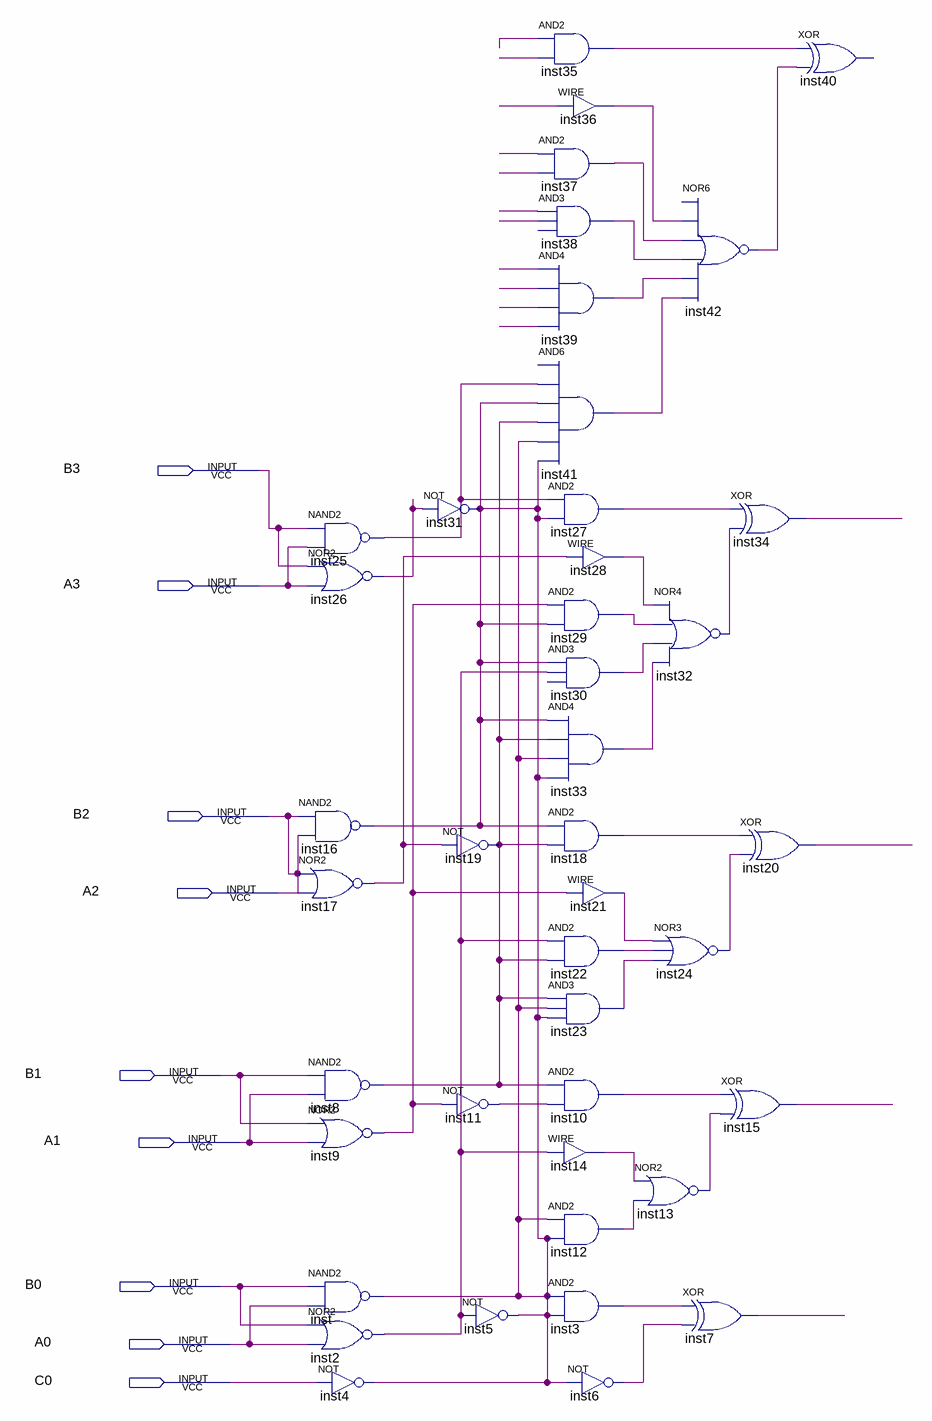
[diagram p0: schematic sheet]
// Quartus schematic soma4_74LS83.bdf as structural Verilog: 42 symbols, 9 pins
module soma4_74LS83 (
  input  B3,
  input  A3,
  input  B2,
  input  A2,
  input  B1,
  input  A1,
  input  B0,
  input  A0,
  input  C0
);

  wire inst2_out, inst3_out, inst6_out, inst7_out, inst8_out, inst9_out, inst10_out, inst11_out, inst12_out,
       inst13_out, inst14_out, inst15_out, inst16_out, inst17_out, inst18_out, inst20_out, inst21_out,
       inst22_out, inst23_out, inst24_out, inst25_out, inst26_out, inst27_out, inst28_out, inst29_out,
       inst30_out, inst32_out, inst33_out, inst34_out, inst35_out, inst36_out, inst37_out, inst38_out,
       inst39_out, inst41_out, inst42_out, undriven, undriven_2, undriven_3, undriven_4, undriven_5,
       undriven_6, undriven_7, undriven_8, undriven_9, undriven_10, undriven_11;

  nand inst25 (inst25_out, B3, A3);
  nor inst26 (inst26_out, B3, A3);
  nand inst16 (inst16_out, A2, A2);
  nor inst17 (inst17_out, A2, A2);
  nand inst8 (inst8_out, B1, A1);
  nor inst9 (inst9_out, B1, A1);
  nand inst (inst16_out, B0, A0);
  nor inst2 (inst2_out, B0, A0);
  not inst4 (inst16_out, C0);
  not inst31 (inst16_out, inst26_out);
  not inst19 (inst8_out, inst17_out);
  not inst11 (inst11_out, inst9_out);
  not inst5 (inst16_out, inst2_out);
  and inst35 (inst35_out, undriven_2, undriven);
  assign inst36_out = undriven_3;  // WIRE inst36
  and inst37 (inst37_out, undriven_4, undriven_5);
  and inst38 (inst38_out, undriven_10, undriven_6);  // open: IN3
  and inst39 (inst39_out, undriven_7, undriven_11, undriven_8, undriven_9);
  and inst41 (inst41_out, inst25_out, inst16_out, inst8_out, inst16_out, inst16_out);  // open: IN1
  and inst27 (inst27_out, inst25_out, inst16_out);
  assign inst28_out = inst17_out;  // WIRE inst28
  and inst29 (inst29_out, inst9_out, inst16_out);
  and inst30 (inst30_out, inst16_out, inst2_out);  // open: IN3
  and inst33 (inst33_out, inst16_out, inst8_out, inst16_out, inst16_out);
  and inst18 (inst18_out, inst16_out, inst8_out);
  assign inst21_out = inst9_out;  // WIRE inst21
  and inst22 (inst22_out, inst2_out, inst8_out);
  and inst23 (inst23_out, inst8_out, inst16_out, inst16_out);
  and inst10 (inst10_out, inst8_out, inst11_out);
  assign inst14_out = inst2_out;  // WIRE inst14
  and inst12 (inst12_out, inst16_out, inst16_out);
  and inst3 (inst3_out, inst16_out, inst16_out);
  not inst6 (inst6_out, inst16_out);
  nor inst32 (inst32_out, inst28_out, inst29_out, inst30_out, inst33_out);
  nor inst24 (inst24_out, inst21_out, inst22_out, inst23_out);
  nor inst13 (inst13_out, inst14_out, inst12_out);
  nor inst42 (inst42_out, inst36_out, inst37_out, inst38_out, inst39_out, inst41_out);  // open: IN1
  xor inst34 (inst34_out, inst27_out, inst32_out);
  xor inst20 (inst20_out, inst18_out, inst24_out);
  xor inst15 (inst15_out, inst10_out, inst13_out);
  xor inst7 (inst7_out, inst3_out, inst6_out);
  // XOR inst40 has open pins: IN1=inst35_out, IN2=inst42_out, OUT=open

  assign B2 = A2;
endmodule
